# Altium schematic sheet Sheet1.SchDoc
size A; SheetNumber: 1; SheetTotal: 1
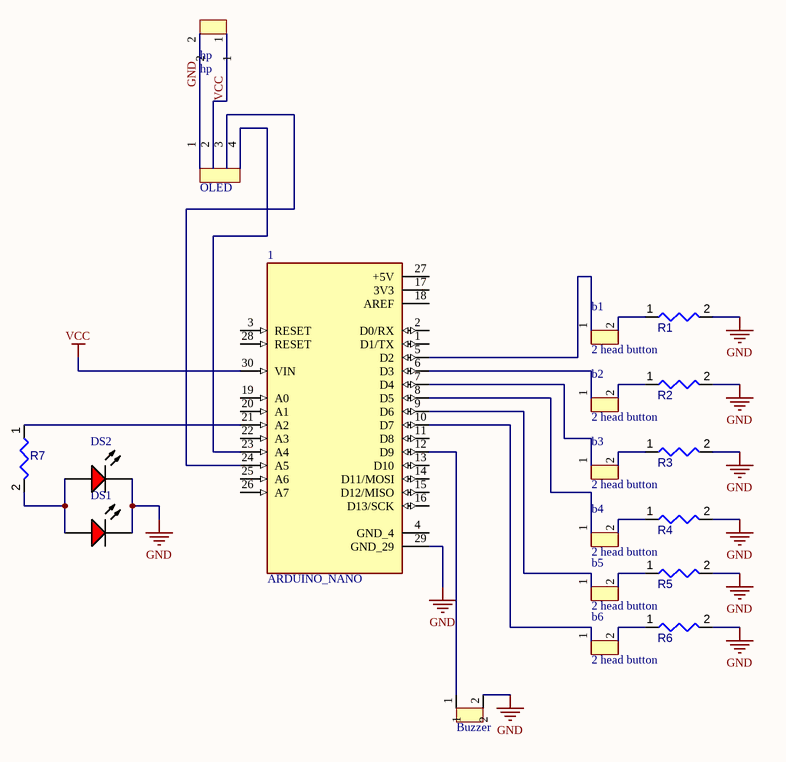
[diagram p0: Sheet1.SchDoc]

## Parts
1  ARDUINO_NANO  [MODULE_ARDUINO_NANO]
b1  2 head button  [2 head button]
b2  2 head button  [2 head button]
b3  2 head button  [2 head button]
b4  2 head button  [2 head button]
b5  2 head button  [2 head button]
b6  2 head button  [2 head button]
Buzzer  Buzzer  [buzzer]  (value not drawn)
DS1  LTL-1CHE  [INDPR60-254-520X380X650]  (value not drawn)
DS2  LTL-1CHE  [INDPR60-254-520X380X650]  (value not drawn)
hp  hp  [hp]
OLED  OLED  [OLED]
R1  Resistors  [RESA86-1060X240]  (value not drawn)
R2  Resistors  [RESA86-1060X240]  (value not drawn)
R3  Resistors  [RESA86-1060X240]  (value not drawn)
R4  Resistors  [RESA86-1060X240]  (value not drawn)
R5  Resistors  [RESA86-1060X240]  (value not drawn)
R6  Resistors  [RESA86-1060X240]  (value not drawn)
R7  Resistors  [RESA86-1060X240]  (value not drawn)

## Nets
GND: 1.29(GND_29) Buzzer.2 DS1.2(K) DS2.2(K) hp.2 OLED.1 R1.2 R2.2 R3.2 R4.2 R5.2 R6.2
VCC: 1.30(VIN) hp.1 OLED.2
Net1_5: 1.5(D2) b1.1
Net1_6: 1.6(D3) b2.1
Net1_7: 1.7(D4) b3.1
Net1_8: 1.8(D5) b4.1
Net1_9: 1.9(D6) b5.1
Net1_10: 1.10(D7) b6.1
Net1_12: 1.12(D9) Buzzer.1
Net1_21: 1.21(A2) R7.1
Net1_23: 1.23(A4) OLED.4
Net1_24: 1.24(A5) OLED.3
Netb1_2: b1.2 R1.1
Netb2_2: b2.2 R2.1
Netb3_2: b3.2 R3.1
Netb4_2: b4.2 R4.1
Netb5_2: b5.2 R5.1
Netb6_2: b6.2 R6.1
NetDS1_1: DS1.1(A) DS2.1(A) R7.2

Not connected (* = marked no-connect by the designer): 1 1(D1/TX) 2(D0/RX) 3(RESET) 4(GND_4) 11(D8) 13(D10) 14(D11/MOSI) 15(D12/MISO) 16(D13/SCK) 17(3V3) 18(AREF) 19(A0) 20(A1) 22(A3) 25(A6) 26(A7) 27(+5V) 28(RESET)

## Library data of the parts
1 = CMP-015-000000-1: Small, complete, and breadboard-friendly board based on the ATmega328 (Arduino Nano 3.x); Value: *; Component Type: Standard; Package: Non-Standard Arduino; MP: Arduino Nano; Check_prices: https://www.snapeda.com/parts/Arduino%20Nano/Arduino/view-part/?ref=eda; Source: ARDUINO_NANO.SchLib; Design Item ID: ARDUINO_NANO; MF: Arduino; Pin Count: 30; SnapEDA_Link: https://www.snapeda.com/parts/Arduino%20Nano/Arduino/view-part/?ref=snap
DS1 DS2 = CMP-007-00018-2: LED Uni-Color Red, 100 mW, 30 mA, -55 to 100 degC, 2-Pin THD, RoHS, Bulk; Manufacturer: Lite-On; Forward Current: 20mA; Nominal Vf: 2V; Viewing Angle: 60degrees; Luminous Intensity: 12.6mcd; Lens Style: Dome; Pins: 2; RoHS Compliant: True; Package Reference: LTL-1CHE; Package Quantity: 1000; Mounting Technology: TH; Min Operating Temperature: -55°C; Colour: Red; Case/Package: Radial; Manufacturer URL: http://www.us.liteon.com/; Datasheet URL: https://datasheet.ciiva.com/15117/getdatasheetpartid-187746-15117985.pdf; Forward Voltage: 2V; Max Operating Temperature: 100°C; Illumination Colour: Red; Package Description: 2-Pin Through Hole Device, Dia 3.8 mm, Pitch 2.54 mm; Packaging: Bulk; Datasheet Version: Dec-03
R1-R7 = Resistors: Resistor; Component Type: Resistors